# EAGLE design Sound Sensor Schematic Rev1 (EAGLE 9.6.2)
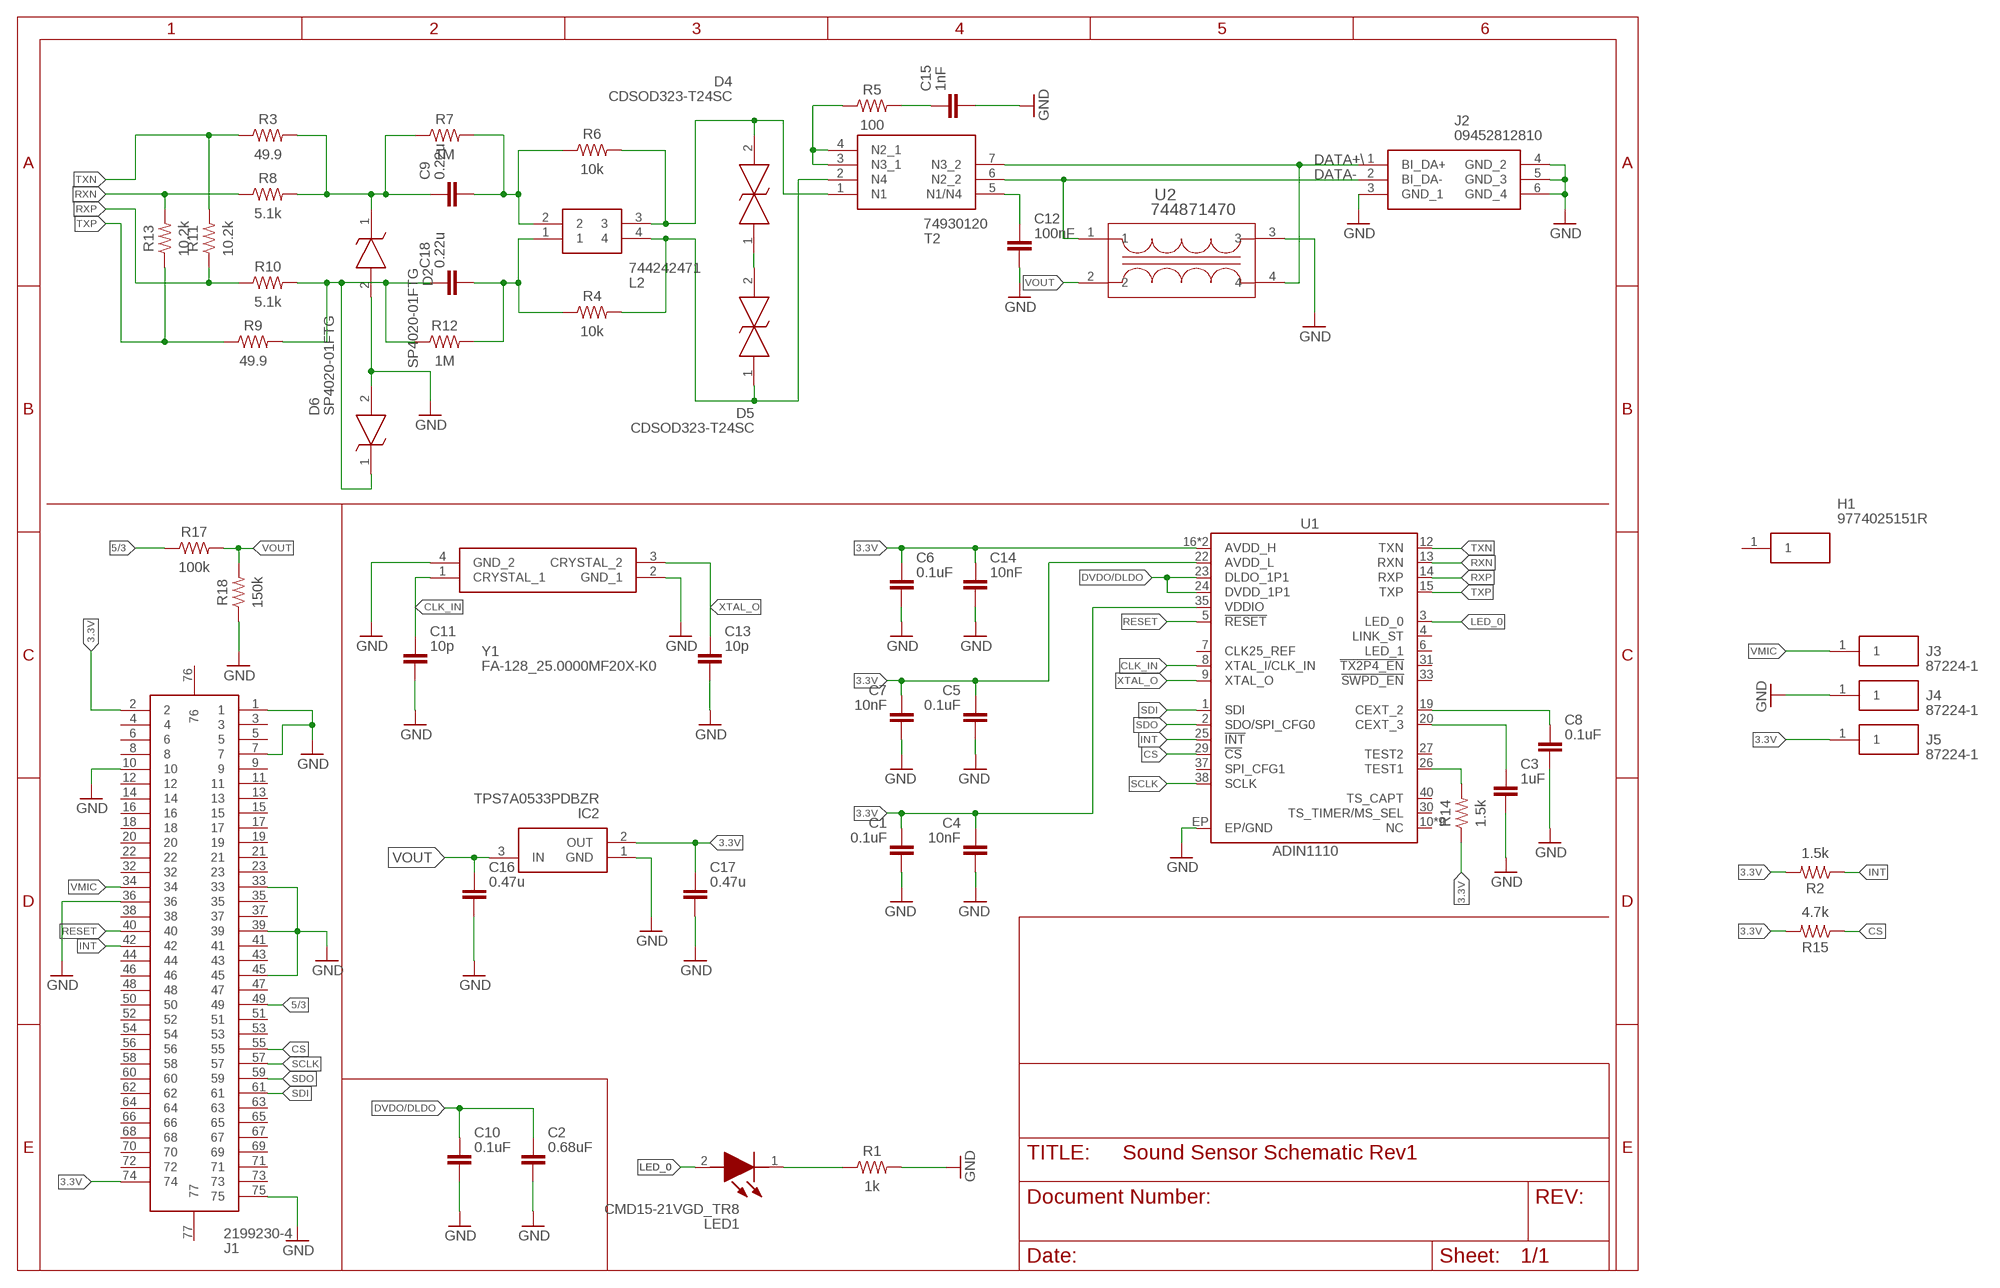
[diagram p0: schematic, sheet 1]

## Parts
C1  0.1uF  C_CHIP-0402(1005-METRIC)  [CAPC1005X60]
C2  0.68uF  C_CHIP-0402(1005-METRIC)  [CAPC1005X60]
C3  1uF  C_CHIP-0402(1005-METRIC)  [CAPC1005X60]
C4  10nF  C_CHIP-0402(1005-METRIC)  [CAPC1005X60]
C5  0.1uF  C_CHIP-0402(1005-METRIC)  [CAPC1005X60]
C6  0.1uF  C_CHIP-0402(1005-METRIC)  [CAPC1005X60]
C7  10nF  C_CHIP-0402(1005-METRIC)  [CAPC1005X60]
C8  0.1uF  C_CHIP-0402(1005-METRIC)  [CAPC1005X60]
C9  0.22u  C_CHIP-0402(1005-METRIC)  [CAPC1005X60]
C10  0.1uF  C_CHIP-0402(1005-METRIC)  [CAPC1005X60]
C11  10p  C_CHIP-0402(1005-METRIC)  [CAPC1005X60]
C12  100nF  C_CHIP-0402(1005-METRIC)  [CAPC1005X60]
C13  10p  C_CHIP-0402(1005-METRIC)  [CAPC1005X60]
C14  10nF  C_CHIP-0402(1005-METRIC)  [CAPC1005X60]
C15  1nF  C_CHIP-0402(1005-METRIC)  [CAPC1005X60]
C16  0.47u  C_CHIP-0402(1005-METRIC)  [CAPC1005X60]
C17  0.47u  C_CHIP-0402(1005-METRIC)  [CAPC1005X60]
C18  0.22u  C_CHIP-0402(1005-METRIC)  [CAPC1005X60]
D2  SP4020-01FTG  [SOD2613X114N]
D4  CDSOD323-T24SC  [SOD2513X114N]
D5  CDSOD323-T24SC  [SOD2513X114N]
D6  SP4020-01FTG  [SOD2613X114N]
H1  9774025151R  [9774025151R]
IC2  TPS7A0533PDBZR  [SOT95P237X112-3N]
J1  2199230-4  [21992304]
J2  09452812810  [09452812810]
J3  87224-1  [HDRV1W66P0X254_1X1_213X254X107]
J4  87224-1  [HDRV1W66P0X254_1X1_213X254X107]
J5  87224-1  [HDRV1W66P0X254_1X1_213X254X107]
L2  744242471  [744242471]
LED1  CMD15-21VGD_TR8  [LEDC3215X130N]
R1  1k  R-US_CHIP-0402(1005-METRIC)  [RESC1005X40]
R2  1.5k  R-US_CHIP-0402(1005-METRIC)  [RESC1005X40]
R3  49.9  R-US_CHIP-0402(1005-METRIC)  [RESC1005X40]
R4  10k  R-US_CHIP-0402(1005-METRIC)  [RESC1005X40]
R5  100  R-US_CHIP-0402(1005-METRIC)  [RESC1005X40]
R6  10k  R-US_CHIP-0402(1005-METRIC)  [RESC1005X40]
R7  1M  R-US_CHIP-0402(1005-METRIC)  [RESC1005X40]
R8  5.1k  R-US_CHIP-0402(1005-METRIC)  [RESC1005X40]
R9  49.9  R-US_CHIP-0402(1005-METRIC)  [RESC1005X40]
R10  5.1k  R-US_CHIP-0402(1005-METRIC)  [RESC1005X40]
R11  10.2k  R-US_CHIP-0402(1005-METRIC)  [RESC1005X40]
R12  1M  R-US_CHIP-0402(1005-METRIC)  [RESC1005X40]
R13  10.2k  R-US_CHIP-0402(1005-METRIC)  [RESC1005X40]
R14  1.5k  R-US_CHIP-0402(1005-METRIC)  [RESC1005X40]
R15  4.7k  R-US_CHIP-0402(1005-METRIC)  [RESC1005X40]
R17  100k  R-US_CHIP-0402(1005-METRIC)  [RESC1005X40]
R18  150k  R-US_CHIP-0402(1005-METRIC)  [RESC1005X40]
T2  74930120  [74930120]
U1  ADIN1110  [LFCSP-40]
U2  744871470  [SMT_871470_WRE]
Y1  FA-128_25.0000MF20X-K0  [FA128250000MF20XK0]

## Nets
3.3V: C1.1 C4.1 C5.1 C6.1 C7.1 C14.1 C17.1 IC2.2(OUT) J1.2 J1.74 J5.1 R2.2 R14.1 R15.2 U1.16(AVDD_H) U1.17(AVDD_H) U1.22(AVDD_L) U1.35(VDDIO)
5/3: J1.49 R17.1
CLK_IN: C11.1 U1.8(XTAL_I/CLK_IN) Y1.1(CRYSTAL_1)
CS: J1.55 R15.1 U1.29(!CS!)
DATA+\: J2.1(BI_DA+) T2.7(N3_2) U2.4
DATA-: J2.2(BI_DA-) T2.6(N2_2) U2.1
DVDO/DLDO: C2.1 C10.1 U1.23(DLDO_1P1) U1.24(DVDD_1P1)
GND: C1.2 C2.2 C3.2 C4.2 C5.2 C6.2 C7.2 C8.2 C10.2 C11.2 C12.2 C13.2 C14.2 C15.2 C16.2 C17.2 D2.2(A) D6.2(A) IC2.1(GND) J1.1 J1.7 J1.10 J1.33 J1.36 J1.39 J1.45 J1.75 J2.3(GND_1) J2.4(GND_2) J2.5(GND_3) J2.6(GND_4) J4.1 R1.2 R18.1 U1.EP(EP/GND) U2.3 Y1.2(GND_1) Y1.4(GND_2)
INT: J1.42 R2.1 U1.25(!INT!)
LED_0: LED1.2(A) U1.3(LED_0)
N$1: C15.1 R5.2
N$2: LED1.1(K) R1.1
N$16: C18.2 L2.1 R4.1 R12.2
N$18: R14.2 U1.26(TEST1)
N$19: C9.2 L2.2 R6.1 R7.2
N$20: D5.1 L2.4 R4.2 T2.2(N4)
N$21: C8.1 U1.19(CEXT_2)
N$22: C3.1 U1.20(CEXT_3)
N$24: C9.1 D2.1(K) R3.2 R7.1 R8.2
N$28: C12.1 T2.5(N1/N4)
N$30: R5.1 T2.3(N3_1) T2.4(N2_1)
N$31: C18.1 D6.1(K) R9.2 R10.2 R12.1
N$42: D4.2 L2.3 R6.2 T2.1(N1)
N$43: D4.1 D5.2
RESET: J1.40 U1.5(!RESET!)
RXN: R8.1 R13.2 U1.13(RXN)
RXP: R10.1 R11.1 U1.14(RXP)
SCLK: J1.57 U1.38(SCLK)
SDI: J1.61 U1.1(SDI)
SDO: J1.59 U1.2(SDO/SPI_CFG0)
TXN: R3.1 R11.2 U1.12(TXN)
TXP: R9.1 R13.1 U1.15(TXP)
VMIC: J1.34 J3.1
VOUT: C16.1 IC2.3(IN) R17.2 R18.2 U2.2
XTAL_O: C13.1 U1.9(XTAL_O) Y1.3(CRYSTAL_2)
Unconnected: H1.1 J1.3 J1.4 J1.5 J1.6 J1.8 J1.9 J1.11 J1.12 J1.13 J1.14 J1.15 J1.16 J1.17 J1.18 J1.19 J1.20 J1.21 J1.22 J1.23 J1.32 J1.35 J1.37 J1.38 J1.41 J1.43 J1.44 J1.46 J1.47 J1.48 J1.50 J1.51 J1.52 J1.53 J1.54 J1.56 J1.58 J1.60 J1.62 J1.63 J1.64 J1.65 J1.66 J1.67 J1.68 J1.69 J1.70 J1.71 J1.72 J1.73 J1.76 J1.77 U1.4(LINK_ST) U1.6(LED_1) U1.7(CLK25_REF) U1.10(NC) U1.11(NC) U1.18(NC) U1.21(NC) U1.27(TEST2) U1.28(NC) U1.30(TS_TIMER/MS_SEL) U1.31(!TX2P4_EN!) U1.32(NC) U1.33(!SWPD_EN!) U1.34(NC) U1.36(NC) U1.37(SPI_CFG1) U1.39(NC) U1.40(TS_CAPT)

## Library data of the parts
C1-C18 = Capacitor:C: Capacitor - Generic; CATEGORY: Capacitor
D2 D6 = SamacSys_Parts:SP4020-01FTG: Littelfuse TVS Diode Array Uni-Directional, 750W Triple, 2-Pin SOD-323 SP4020-01FTG, Source: Datasheet <https://www.littelfuse.com/~/media/electronics/datasheets/tvs_diode_arrays/littelfuse_tvs_diode_array_sp4020_datasheet.pdf.pdf>; DESCRIPTION: Littelfuse TVS Diode Array Uni-Directional, 750W Triple, 2-Pin SOD-323 SP4020-01FTG,; HEIGHT: 1.14mm; MANUFACTURER_NAME: LITTELFUSE; MANUFACTURER_PART_NUMBER: SP4020-01FTG; MOUSER_PART_NUMBER: 576-SP4020-01FTG; MOUSER_PRICE-STOCK: https://www.mouser.co.uk/ProductDetail/Littelfuse/SP4020-01FTG?qs=eIdvKxokjW4Yi6Ov7kZjPg%3D%3D
D4 D5 = SamacSys_Parts:CDSOD323-T24SC: ESD Suppressors / TVS Diodes Bidirectional Std Cap Source: Datasheet <https://www.bourns.com/docs/Product-Datasheets/CDSOD323-TxxLC.pdf>; ARROW_PART_NUMBER: CDSOD323-T24SC; ARROW_PRICE-STOCK: https://www.arrow.com/en/products/cdsod323-t24sc/bourns?region=nac; DESCRIPTION: ESD Suppressors / TVS Diodes Bidirectional Std Cap; HEIGHT: 1.14mm; MANUFACTURER_NAME: Bourns; MANUFACTURER_PART_NUMBER: CDSOD323-T24SC; MOUSER_PART_NUMBER: 652-CDSOD323-T24SC; MOUSER_PRICE-STOCK: https://www.mouser.co.uk/ProductDetail/Bourns/CDSOD323-T24SC?qs=6S5Watp5UnLXKCNVDRqkmw%3D%3D
H1 = 9774025151R:9774025151R: 9774025151R, 2.5mm High Steel Round Spacer With 5.1mm Diameter and 3.5mm Bore Diameter for M2.5 Screw Source: Datasheet <https://componentsearchengine.com/Datasheets/2/9774025151R.pdf>; DESCRIPTION: 9774025151R, 2.5mm High Steel Round Spacer With 5.1mm Diameter and 3.5mm Bore Diameter for M2.5 Screw; HEIGHT: 3.9mm; MANUFACTURER_NAME: Wurth Elektronik; MANUFACTURER_PART_NUMBER: 9774025151R; MOUSER_PART_NUMBER: 710-9774025151R; MOUSER_PRICE-STOCK: https://www.mouser.co.uk/ProductDetail/Wurth-Elektronik/9774025151R?qs=KRpiEsko4Hn1l7MecUfDpA%3D%3D
IC2 = SamacSys_Parts:TPS7A0533PDBZR: 1-A, ultra-low-IQ, 200-mA low-dropout (LDO) regulator in a small-sized package Source: Datasheet <https://www.ti.com/lit/gpn/TPS7A05>; DESCRIPTION: 1-A, ultra-low-IQ, 200-mA low-dropout (LDO) regulator in a small-sized package; HEIGHT: 1.12mm; MANUFACTURER_NAME: Texas Instruments; MANUFACTURER_PART_NUMBER: TPS7A0533PDBZR; MOUSER_PART_NUMBER: 595-TPS7A0533PDBZR; MOUSER_PRICE-STOCK: https://www.mouser.co.uk/ProductDetail/Texas-Instruments/TPS7A0533PDBZR?qs=XeJtXLiO41SvDtfTV1kb9A%3D%3D
J1 = SamacSys_Parts:2199230-4: AMP - TE CONNECTIVITY - 2199230-4 - CONNECTOR, CARD EDGE, RCPT, 67POS, 2ROW Source: Datasheet <https://www.te.com/commerce/DocumentDelivery/DDEController?Action=srchrtrv&DocNm=2199230&DocType=Customer Drawing&DocLang=English&DocFormat=pdf&PartCntxt=2199230-4>; DESCRIPTION: AMP - TE CONNECTIVITY - 2199230-4 - CONNECTOR, CARD EDGE, RCPT, 67POS, 2ROW; HEIGHT: mm; MANUFACTURER_NAME: TE Connectivity; MANUFACTURER_PART_NUMBER: 2199230-4; MOUSER_PART_NUMBER: 571-2199230-4; MOUSER_PRICE-STOCK: https://www.mouser.co.uk/ProductDetail/TE-Connectivity/2199230-4?qs=EQCnRgr4b6HnhitEoflgGQ%3D%3D
J2 = SamacSys_Parts:09452812810: T1 Industrial Jack Connectors, PCB connector, Angled, THR connection, Rated current: 4 A, Contacts: 2, + shielding Source: Datasheet <https://b2b.harting.com/files/download/PRD/PDF_TS/09452812810_100689697DRW003M.pdf?siteName=Ebusiness Site&autoLogoutEnabled=false&autoLogoutTime=0&contextURL=https://b2b.harting.com/ebusiness/en&maintenanceAnnouncement={ }&showPrivacyEmailA>; DESCRIPTION: T1 Industrial Jack Connectors, PCB connector, Angled, THR connection, Rated current: 4 A, Contacts: 2, + shielding; HEIGHT: 6.1mm; MANUFACTURER_NAME: HARTING; MANUFACTURER_PART_NUMBER: 09452812810; MOUSER_PART_NUMBER: 617-09452812810; MOUSER_PRICE-STOCK: https://www.mouser.co.uk/ProductDetail/HARTING/09452812810?qs=IPgv5n7u5QYWjjwXDCl9%252Bw%3D%3D
J3-J5 = SamacSys_Parts:87224-1: 01 MODII HDR SRST UNSHRD .100 Source: Datasheet <https://www.te.com/commerce/DocumentDelivery/DDEController?Action=srchrtrv&DocNm=87224&DocType=Customer Drawing&DocLang=English>; ARROW_PART_NUMBER: 87224-1; ARROW_PRICE-STOCK: https://www.arrow.com/en/products/87224-1/te-connectivity?region=nac; DESCRIPTION: 01 MODII HDR SRST UNSHRD .100; HEIGHT: 10.744mm; MANUFACTURER_NAME: TE Connectivity; MANUFACTURER_PART_NUMBER: 87224-1; MOUSER_PART_NUMBER: 571-872241; MOUSER_PRICE-STOCK: https://www.mouser.co.uk/ProductDetail/TE-Connectivity/87224-1?qs=uJX40y%252BSWqgHHhtbHlovpg%3D%3D
L2 = SamacSys_Parts:744242471: WE-SLM SMD Common Mode Choke 470uH 400mA Source: Datasheet <http://katalog.we-online.com/pbs/datasheet/744242471.pdf>; DESCRIPTION: WE-SLM SMD Common Mode Choke 470uH 400mA; HEIGHT: 3mm; MANUFACTURER_NAME: Wurth Elektronik; MANUFACTURER_PART_NUMBER: 744242471; MOUSER_PART_NUMBER: 710-744242471; MOUSER_PRICE-STOCK: https://www.mouser.co.uk/ProductDetail/Wurth-Elektronik/744242471?qs=PGXP4M47uW7UIiGXUC0ZiA%3D%3D
LED1 = SamacSys_Parts:CMD15-21VGD_TR8: VCC CMD15-21VGD/TR8, CMD15-21 Series Clear LED, 570 nm,, Rectangle Lens Source: Datasheet <https://componentsearchengine.com/Datasheets/2/CMD15-21VGD_TR8.pdf>; ARROW_PART_NUMBER: CMD15-21VGD/TR8; ARROW_PRICE-STOCK: https://www.arrow.com/en/products/cmd15-21vgdtr8/visual-communications; DESCRIPTION: VCC CMD15-21VGD/TR8, CMD15-21 Series Clear LED, 570 nm,, Rectangle Lens; HEIGHT: 1.3mm; MANUFACTURER_NAME: Visual Communications Company; MANUFACTURER_PART_NUMBER: CMD15-21VGD/TR8; MOUSER_PART_NUMBER: 606-CMD15-21VGD/TR8; MOUSER_PRICE-STOCK: https://www.mouser.co.uk/ProductDetail/VCC/CMD15-21VGD-TR8?qs=rmKzSijf6EYPDoIZjcp6ew%3D%3D
R1-R15 R17 R18 = Resistor:R-US: Resistor Fixed - ANSI; CATEGORY: Resistor; SUB-CATEGORY: Fixed
T2 = SamacSys_Parts:74930120: WURTH ELEKTRONIK - 74930120 - Transformer, Ethernet, 1P, 10/100/1000/10G Base-T, PoE+, 1:1, Surface Mount Source: Datasheet <https://www.we-online.com/catalog/datasheet/74930120.pdf>; DESCRIPTION: WURTH ELEKTRONIK - 74930120 - Transformer, Ethernet, 1P, 10/100/1000/10G Base-T, PoE+, 1:1, Surface Mount; HEIGHT: 2.9mm; MANUFACTURER_NAME: Wurth Elektronik; MANUFACTURER_PART_NUMBER: 74930120; MOUSER_PART_NUMBER: 710-74930120; MOUSER_PRICE-STOCK: https://www.mouser.co.uk/ProductDetail/Wurth-Elektronik/74930120?qs=zW32dvEIR3sEJWqR2tCkqQ%3D%3D
U1 = ADIN1110:ADIN1110: The ADIN1110 is an ultra low power, single port, 10BASE-T1L transceiver design for industrial Ethernet applications and is compliant with the IEEE® 802.3cg-2019™ Ethernet standard for long reach, 10 Mbps single pair Ethernet (SPE).; PROD_ID: IC-16335
U2 = 744871470:744871470; COPYRIGHT: Copyright (C) 2023 Ultra Librarian. All rights reserved.; MANUFACTURER_PART_NUMBER: 744871470; MFR_NAME: Wurth Electronics
Y1 = SamacSys_Parts:FA-128_25.0000MF20X-K0: Crystals 25MHz 10PPM -40C +85C 10pF Source: Datasheet <https://support.epson.biz/td/api/doc_check.php?dl=brief_FA-128&lang=en>; DESCRIPTION: Crystals 25MHz 10PPM -40C +85C 10pF; HEIGHT: 0.5mm; MANUFACTURER_NAME: Epson Timing; MANUFACTURER_PART_NUMBER: FA-128 25.0000MF20X-K0; MOUSER_PART_NUMBER: 732-FA-12825F20X-K0; MOUSER_PRICE-STOCK: https://www.mouser.co.uk/ProductDetail/Epson-Timing/FA-128-250000MF20X-K0?qs=csoGsJbXmtBBrE23v3bRHg%3D%3D

## Board
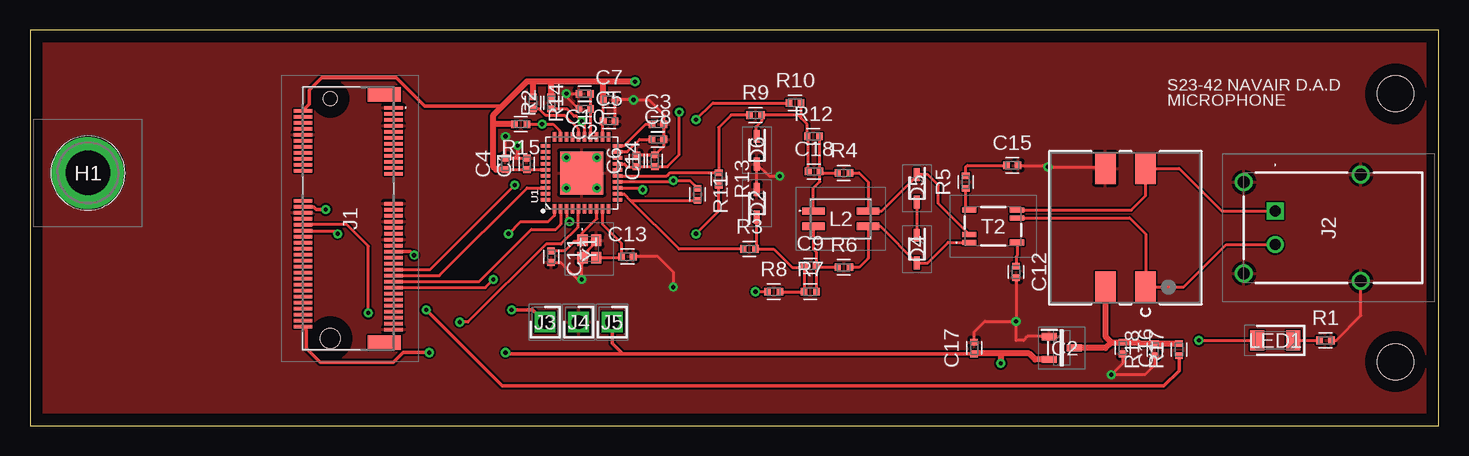
[diagram p1: board, top side]
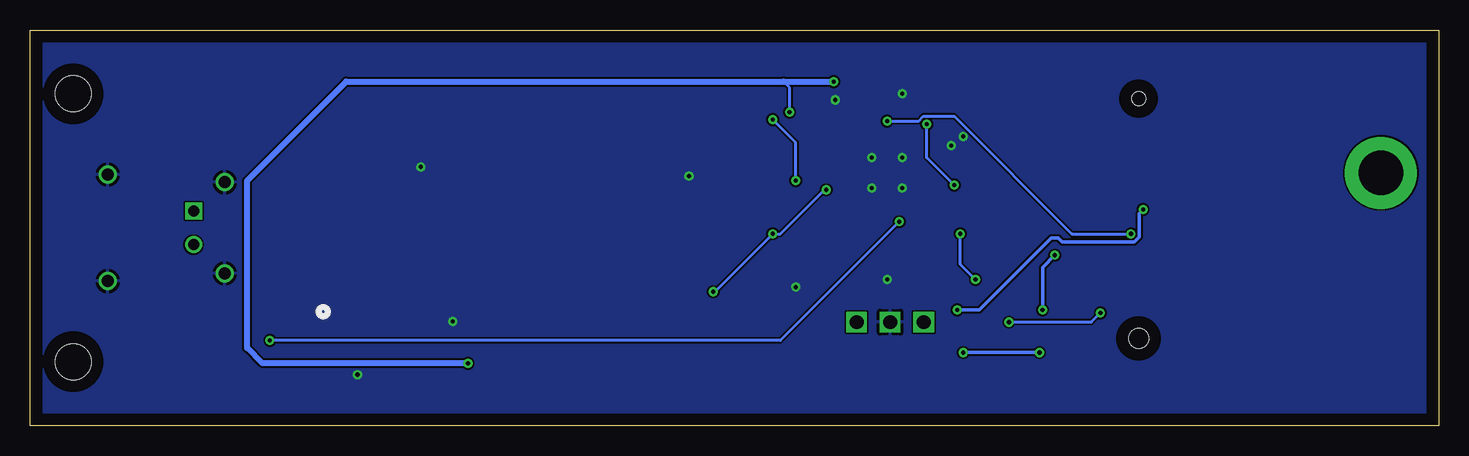
[diagram p2: board, bottom side, seen from below]

Size 117.4 x 33.01 mm. Coordinates in mm from the lower left corner, seen from the top.
Outline: 0,0 117.4,0 117.4,33.01 0,33.01 0,0
Copper layers (1*16): Top 0.035mm / dielectric 1.5mm / Bottom 0.035mm
Design rules "default": minimum track width 6mil, minimum drill 0.35mm, track to track 6mil, track to pad 6mil, pad to pad 6mil, via to via 6mil, smd to smd 6mil, copper to edge 40mil, drill to drill 6mil, minimum pad ring 10mil, minimum via ring 8mil, stop-mask expansion 4mil, vias tented up to drill 0mil, thermal gap 10mil
Holes 3 mm at 113.79,5.33 113.79,27.69

### Footprints (pad centres in the part's own frame; a part is rotated, then mirrored left to right if it is on the bottom)
CAPC1005X60 = smd 0.56 x 0.629: 1 -0.485,0; 2 0.485,0
SOD2613X114N = smd 1.075 x 0.5: 1 -1.15,0; 2 1.15,0
SOD2513X114N = smd 1.075 x 0.5: 1 -1.15,0; 2 1.15,0
9774025151R = drill 3.7 pad 6: 1 0,0
SOT95P237X112-3N = smd 1.25 x 0.6: 1 -1.05,0.95; 2 -1.05,-0.95; 3 1.05,0
21992304 = smd 0.3 x 1.55: 1 -9.25,3.625; 2 -9,-3.925; 3 -8.75,3.625; 4 -8.5,-3.925; 5 -8.25,3.625; 6 -8,-3.925; 7 -7.75,3.625; 8 -7.5,-3.925; 9 -7.25,3.625; 10 -7,-3.925; 11 -6.75,3.625; 12 -6.5,-3.925; 13 -6.25,3.625; 14 -6,-3.925; 15 -5.75,3.625; 16 -5.5,-3.925; 17 -5.25,3.625; 18 -5,-3.925; 19 -4.75,3.625; 20 -4.5,-3.925; 21 -4.25,3.625; 22 -4,-3.925; 23 -3.75,3.625; 32 -1.5,-3.925; 33 -1.25,3.625; 34 -1,-3.925; 35 -0.75,3.625; 36 -0.5,-3.925; 37 -0.25,3.625; 38 0,-3.925; 39 0.25,3.625; 40 0.5,-3.925; 41 0.75,3.625; 42 1,-3.925; 43 1.25,3.625; 44 1.5,-3.925; 45 1.75,3.625; 46 2,-3.925; 47 2.25,3.625; 48 2.5,-3.925; 49 2.75,3.625; 50 3,-3.925; 51 3.25,3.625; 52 3.5,-3.925; 53 3.75,3.625; 54 4,-3.925; 55 4.25,3.625; 56 4.5,-3.925; 57 4.75,3.625; 58 5,-3.925; 59 5.25,3.625; 60 5.5,-3.925; 61 5.75,3.625; 62 6,-3.925; 63 6.25,3.625; 64 6.5,-3.925; 65 6.75,3.625; 66 7,-3.925; 67 7.25,3.625; 68 7.5,-3.925; 69 7.75,3.625; 70 8,-3.925; 71 8.25,3.625; 72 8.5,-3.925; 73 8.75,3.625; 74 9,-3.925; 75 9.25,3.625 | smd 1.2 x 2.75: 76 -10.35,2.85; 77 10.35,2.85 | hole 1.15: -10,-1.65 | hole 1.65: 10,-1.65
09452812810 = drill 0.9 pad 1.4 square: 1 0,0 | drill 0.9 pad 1.4: 2 -2.8,0 | drill 1 pad 1.5: 3 -5.2,2.6; 4 2.4,2.6; 5 -5.85,-7.15; 6 3.05,-7.15
HDRV1W66P0X254_1X1_213X254X107 = drill 1.15 pad 1.725 square: 1 0,0
744242471 = smd 1.85 x 0.6: 1 -2.275,0.635; 2 -2.275,-0.635; 3 2.275,-0.635; 4 2.275,0.635
LEDC3215X130N = smd 1.15 x 1.7: 1 -1.5,0; 2 1.5,0
RESC1005X40 = smd 0.535 x 0.644: 1 -0.507,0; 2 0.507,0
74930120 = smd 1.2 x 0.41: 1 -1.99,-1.35; 2 -1.99,-0.7; 6 1.99,0.7; 7 1.99,1.35 | smd 0.6 x 0.41: 3 -2.29,1.35; 4 -1.69,1.35 | smd 1.2 x 0.5: 5 1.99,-1.35
LFCSP-40 = smd 0.8 x 0.285: 1 -3,2.25; 2 -3,1.75; 3 -3,1.25; 4 -3,0.75; 5 -3,0.25; 6 -3,-0.25; 7 -3,-0.75; 8 -3,-1.25; 9 -3,-1.75; 10 -3,-2.25; 21 3,-2.25; 22 3,-1.75; 23 3,-1.25; 24 3,-0.75; 25 3,-0.25; 26 3,0.25; 27 3,0.75; 28 3,1.25; 29 3,1.75; 30 3,2.25 | smd 0.285 x 0.8: 11 -2.25,-3; 12 -1.75,-3; 13 -1.25,-3; 14 -0.75,-3; 15 -0.25,-3; 16 0.25,-3; 17 0.75,-3; 18 1.25,-3; 19 1.75,-3; 20 2.25,-3; 31 2.25,3; 32 1.75,3; 33 1.25,3; 34 0.75,3; 35 0.25,3; 36 -0.25,3; 37 -0.75,3; 38 -1.25,3; 39 -1.75,3; 40 -2.25,3 | smd 3.6 x 3.6: EP 0,0
SMT_871470_WRE = smd 2.591 x 1.702: 1 0,0; 2 0,3.35; 3 9.9,3.35; 4 9.9,0
FA128250000MF20XK0 = smd 0.95 x 0.85: 1 -0.725,-0.575; 2 0.725,-0.575; 3 0.725,0.575; 4 -0.725,0.575

### Placement (x,y rotation side)
C1  41.4,21.84 90 top
C2  46.23,26.42 180 top
C3  52.32,25.15 0 top
C4  39.62,21.84 90 top
C5  48.26,25.4 0 top
C6  50.55,22.1 90 top
C7  48.26,27.18 0 top
C8  52.32,23.88 0 top
C9  65.02,13.34 0 top
C10  46.23,27.69 180 top
C11  43.43,14.1 270 top
C12  82.17,12.83 270 top
C13  49.78,14.1 0 top
C14  52.07,22.1 90 top
C15  81.85,21.72 0 top
C16  91.06,6.48 270 top
C17  78.68,6.48 90 top
C18  65.34,21.21 0 top
D2  60.58,18.54 90 top
D4  73.91,14.73 270 top
D5  73.91,19.81 270 top
D6  60.58,22.99 270 top
H1  4.83,21.08 0 top
IC2  85.98,6.48 0 top
J1  26.67,17.27 270 top
J2  103.76,17.91 90 top
J3  42.93,8.64 0 top
J4  45.72,8.64 0 top
J5  48.51,8.64 0 top
L2  67.56,17.27 0 top
LED1  103.76,7.11 180 top
R1  107.95,7.11 0 top
R2  43.43,26.92 90 top
R3  59.94,14.73 0 top
R4  67.82,21.08 0 top
R5  77.98,20.32 90 top
R6  67.82,13.21 0 top
R7  65.02,11.18 0 top
R8  61.98,11.18 0 top
R9  60.45,25.91 0 top
R10  63.75,26.92 0 top
R11  55.63,19.3 270 top
R12  65.28,24.13 0 top
R13  57.4,20.57 270 top
R14  41.91,26.92 270 top
R15  40.89,25.15 180 top
R17  95.76,6.35 90 top
R18  93.73,6.35 90 top
T2  80.26,16.64 0 top
U1  45.97,21.08 90 top
U2  92.96,11.56 90 top
Y1  46.61,14.73 270 top

### Tracks (layer width: path | path; a pad name or v marks a point on that pad's centre or on a via)
3.3V  (via drill 0.35)
  Top 0.254: U1.16 U1.17 49.54,21.83 49.78,21.59 50.52,21.59 C6.1 C14.1 53.11,21.61 54.1,22.61 v54.1,26.16 | U1.22 47.72,25.35 C5.1 C7.1 | C4.1 C1.1 42.95,21.36 U1.35
  Top 0.305: J1.2 23.28,26.8 23.28,27.99 24.3,29.02 30.53,29.02 32.88,26.67 39.37,26.67 | C17.1 49.38,5.99 | 49.38,5.99 39.73,5.99 v39.62,6.1 | v33.27,6.1 31.1,6.1 30.28,5.28 24.19,5.28 23.03,6.45 23.03,7.99 J1.74 | 49.38,5.99 48.51,6.86 J5.1
  Top 0.508: IC2.2 83.75,5.53 83.26,6.02 80.9,6.02 | 80.9,6.02 v80.9,5.21 | 80.9,6.02 78.7,6.02 C17.1 | v50.42,28.7 47.75,28.7 | 47.75,28.7 43.43,28.7 | 43.43,28.7 41.91,28.7 | 41.91,28.7 41.4,28.7 39.37,26.67 38.61,25.91 38.61,25.15 | 41.91,28.7 R14.1 | C7.1 47.75,27.2 47.75,28.7 | C4.1 38.84,21.36 38.61,21.59 38.61,25.15 | R2.2 43.43,28.7 | R15.2 38.61,25.15
  Bottom 0.254: v54.1,26.16 54.1,28.19 54.61,28.7
  Bottom 0.305: v39.62,6.1 v33.27,6.1
  Bottom 0.508: v80.9,5.21 98.04,5.21 99.31,6.48 99.31,20.45 91.06,28.7 54.61,28.7 v50.42,28.7
5/3  (via drill 0.35)
  Top 0.305: R17.1 95.76,4.57 94.49,3.3 39.37,3.3 v33.02,9.65 | J1.49 31.71,14.52 v32,14.22
  Bottom 0.305: v32,14.22 33.02,13.21 v33.02,9.65
CLK_IN
  Top 0.254: U1.8 47.24,18.06 47.24,17.27 46.03,16.06 Y1.1 45.94,15.37 45.34,15.37 44.55,14.58 C11.1
CS  (via drill 0.35)
  Top 0.254: U1.29 44.15,24.16 44.15,24.6 43.6,25.15 v42.67,25.15 R15.1 | v40.39,20.07 33.34,13.02 J1.55
  Bottom 0.254: v40.39,20.07 42.67,22.35 v42.67,25.15
DATA+\
  Top 0.254: J2.1 99.31,17.91 95.76,21.46 U2.4 92.96,19.18 91.77,17.99 T2.7
DATA-
  Top 0.254: J2.2 99.69,15.11 96.14,11.56 U2.1 92.96,16 91.63,17.34 T2.6
DVDO/DLDO
  Top 0.254: U1.23 U1.24 46.72,26.41 C2.1 C10.1
GND  (via drill 0.35)
  Top 0.254: v53.59,11.56 53.59,12.83 52.32,14.1 C13.2 | 46.03,13.52 Y1.2 | Y1.2 46.48,14.45 46.48,14.6 47.18,15.3 Y1.4 | Y1.2 45.97,13.95 v45.97,12.19 45.66,12.19 44.24,13.61 C11.2 | v82.17,8.7 82.17,7.11 82.8,7.11 83.12,7.43 IC2.1 | J2.5 110.91,9.18 108.84,7.11 R1.2 | U1.EP v44.7,19.81 | C12.2 v82.17,8.7 | C16.2 91.06,5.21 v90.11,4.25 92.9,4.25 93.73,5.08 R18.1 | C17.2 78.68,7.81 79.57,8.7 v82.17,8.7 | C15.2 84.71,21.72 v84.84,21.59 89.48,21.59 U2.3 | C5.2 C7.2 v50.29,27.18 51.56,27.18 52.81,25.93 C3.2 C8.2 52.81,23.32 C14.2 C6.2 | D2.2 D6.2 61.59,20.83 v62.48,20.83 | C2.2 44.7,27.45 v44.7,27.69 C10.2 | C1.2 40.39,22.33 C4.2 v39.62,24.13
  Top 0.305: v40.64,23.37 40.64,22.58 40.39,22.33
  other vias: 44.7,22.35 47.24,22.35 47.24,19.81
  pour Bottom: 0,0 0,33.02 121.41,33.02 121.41,0
  pour Top: 0,0 0,33.02 121.41,33.02 121.41,0
INT  (via drill 0.35)
  Top 0.254: U1.25 46.22,25.15 v45.97,25.4 45.55,25.82 45.35,25.82 44.75,26.42 R2.1 | J1.42 22.82,16.2 25.45,16.2 v25.65,16
  Bottom 0.254: v25.65,16 30.57,16 40.37,25.8 42.94,25.8 43.35,25.4 v45.97,25.4
LED_0  (via drill 0.35)
  Top 0.254: v97.41,7.11 LED1.2 | U1.3 44.72,17.25 v44.96,17.02
  Bottom 0.254: v44.96,17.02 54.86,7.11 v97.41,7.11
N$1
  Top 0.254: R5.2 77.98,21.59 78.11,21.72 C15.1
N$2
  Top 0.254: LED1.1 R1.1
N$16
  Top 0.254: L2.1 65.29,19.82 65.83,20.36 C18.2 | C18.2 65.95,21.08 R4.1 | C18.2 65.83,24.09 R12.2
N$18
  Top 0.254: U1.26 45.72,24.72 44.57,25.87 43,25.87 42.45,26.42 R14.2
N$19
  Top 0.254: R6.1 65.64,13.21 C9.2 | C9.2 65.53,13.31 R7.2 | L2.2 65.29,14.72 65.53,14.48 65.53,13.36 C9.2
N$20
  Top 0.254: R4.2 69.09,21.08 69.84,20.33 L2.4 70.99,17.91 73.91,20.83 D5.1 74.8,20.96 75.69,20.07 75.69,18.52 T2.2
N$21
  Top 0.254: U1.19 49,22.86 49.78,22.86 50.8,23.88 C8.1
N$22
  Top 0.254: U1.20 49.01,23.37 49.53,23.37 51.31,25.15 C3.1
N$24
  Top 0.254: R8.2 R7.1 64.52,13.31 C9.1 64.41,13.21 63.5,13.21 61.98,14.73 R3.2 60.58,14.86 D2.1
N$28
  Top 0.254: T2.5 82.25,14.18 82.17,14.1 C12.1
N$30
  Top 0.254: R5.1 T2.3 T2.4
N$31
  Top 0.254: C18.1 64.86,24.04 R12.1 64.77,25.15 64.26,25.65 | 64.26,25.65 R10.2 | 64.26,25.65 64.01,25.91 R9.2 60.96,25.4 60.52,24.96 60.52,24.2 D6.1
N$42
  Top 0.254: R6.2 69.09,13.21 69.84,13.96 L2.3 70.86,16.64 D4.2 74.8,13.58 76.5,15.29 T2.1
N$43
  Top 0.254: D5.2 D4.1
RESET  (via drill 0.35)
  Top 0.254: U1.5 45.65,18 45.65,16.55 44.24,15.14 43,15.14 36.5,8.64 v35.81,8.64 | v28.19,9.4 28.19,14.99 26.41,16.77 J1.40
  Bottom 0.254: v35.81,8.64 28.96,8.64 v28.19,9.4
RXN  (via drill 0.35)
  Top 0.254: v51.05,19.67 50.9,19.83 U1.13 | R8.1 v60.45,11.18 | v55.5,16 57.4,17.91 R13.2
  Bottom 0.254: v51.05,19.67 51.05,19.81 54.86,16 v55.5,16 60.33,11.18 v60.45,11.18
RXP  (via drill 0.35)
  Top 0.254: U1.14 53.48,20.33 v53.59,20.45 54.99,20.45 R11.1 | v55.5,25.53 56.9,26.92 R10.1
  Bottom 0.254: v53.59,20.45 53.59,23.62 v55.5,25.53
SCLK
  Top 0.254: J1.57 34.11,12.52 41.42,19.83 U1.38
SDI  (via drill 0.35)
  Top 0.254: U1.1 43.69,18.05 43.69,17.53 43.18,17.02 40.89,17.02 v39.88,16 | J1.61 37.94,11.52 v38.61,12.19
  Bottom 0.254: v38.61,12.19 39.88,13.46 v39.88,16
SDO
  Top 0.254: U1.2 44.22,16.79 43.81,16.38 41.78,16.38 37.42,12.02 J1.59
TXN
  Top 0.254: U1.12 49.5,19.33 50.04,18.8 | 50.04,18.8 R11.2 | R3.1 54.1,14.73 50.04,18.8
TXP
  Top 0.254: 57.38,21.11 53.32,21.11 53.05,20.83 U1.15 | 57.38,21.11 R13.1 | R9.1 58.42,25.91 57.38,24.87 57.38,21.11
VMIC  (via drill 0.35)
  Top 0.305: J3.1 41.91,9.65 v40.13,9.65 | J1.34 22.79,18.23 23.65,18.23 23.84,18.03 v24.64,18.03
  Bottom 0.305: v40.13,9.65 38.3,9.65 32.29,15.67 31.72,15.67 31.37,15.32 25.37,15.32 24.97,15.72 24.97,17.7 v24.64,18.03
VOUT
  Top 0.508: U2.2 89.61,7.45 90.1,6.96 | 90.1,6.96 C16.1 92.35,6.96 92.46,6.86 R18.2 R17.2 | 90.1,6.96 89.62,6.48 IC2.3
XTAL_O
  Top 0.254: Y1.3 49.21,14.01 C13.1 49.3,15.22 47.72,16.79 U1.9

### Text on the board
tPlace: S23-42 NAVAIR D.A.D | MICROPHONE